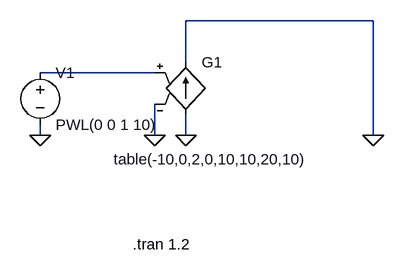
[diagram p0: schematic modelo_transistor_ideal .asc]
modelo_transistor_ideal .asc, the LTspice schematic file:
Version 4
SHEET 1 996 680
WIRE 288 -64 0 -64
WIRE 0 0 0 -64
WIRE -48 16 -224 16
WIRE -224 112 -224 96
WIRE -48 112 -48 64
WIRE 0 112 0 80
WIRE 288 112 288 -64
FLAG 0 112 0
FLAG 288 112 0
FLAG -48 112 0
FLAG -224 112 0
SYMBOL g 0 -16 R0
WINDOW 3 -111 165 Left 2
SYMATTR InstName G1
SYMATTR Value table(-10,0,2,0,10,10,20,10)
SYMBOL voltage -224 0 R0
WINDOW 123 0 0 Left 2
WINDOW 39 0 0 Left 2
SYMATTR InstName V1
SYMATTR Value PWL(0 0 1 10)
TEXT -82 280 Left 2 !.tran 1.2

The netlist it stands for:
* modelo_transistor_ideal .asc
G1 0 0 N001 0 table(-10,0,2,0,10,10,20,10)
V1 N001 0 PWL(0 0 1 10)
.tran 1.2
.backanno
.end